# Altium schematic sheet 16_FPGA_pwr_banks.SchDoc: FPGA power banks
size A3; Organization: Lime Microsystems; Address1: Surrey Tech Centre; Address2: Guildford GU2 7YG; Address3: Surrey; Address4: United Kingdom; Revision: v1.2; SheetNumber: 14; SheetTotal: 27
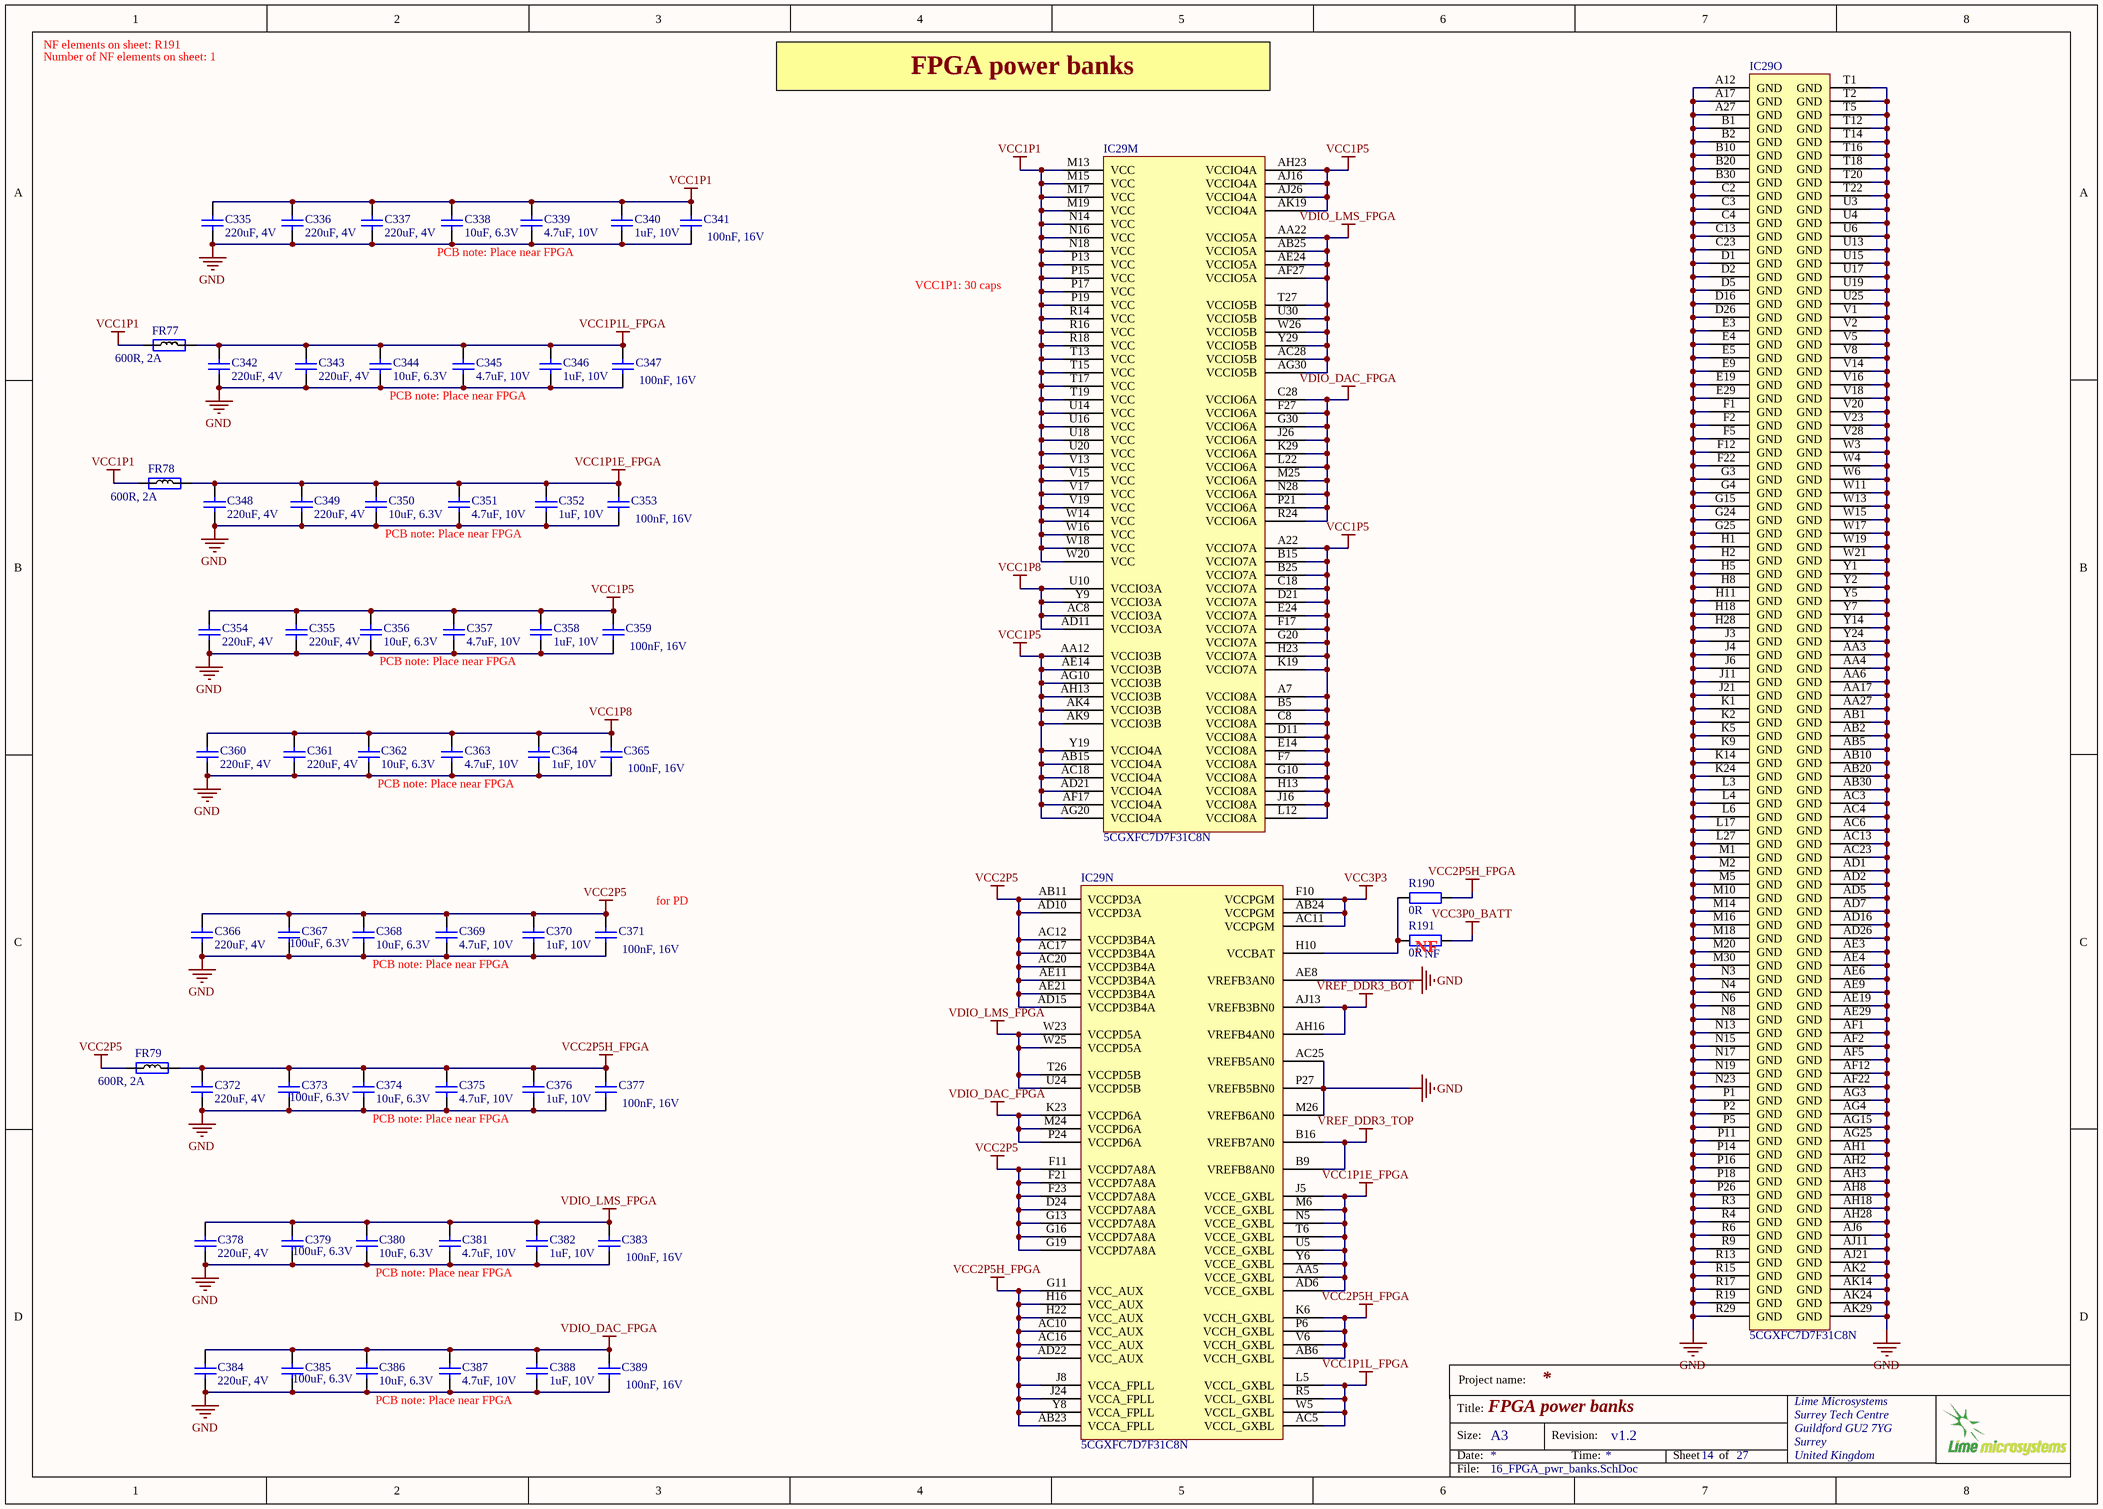
[diagram p0: 16_FPGA_pwr_banks.SchDoc]

## Parts
C335  220uF, 4V  [CAP1206]
C336  220uF, 4V  [CAP1206]
C337  220uF, 4V  [CAP1206]
C338  10uF, 6.3V  [CAP0603]
C339  4.7uF, 10V  [CAP0603]
C340  1uF, 10V  [CAP0402]
C341  100nF, 16V  [CAP0402]
C342  220uF, 4V  [CAP1206]
C343  220uF, 4V  [CAP1206]
C344  10uF, 6.3V  [CAP0603]
C345  4.7uF, 10V  [CAP0603]
C346  1uF, 10V  [CAP0402]
C347  100nF, 16V  [CAP0402]
C348  220uF, 4V  [CAP1206]
C349  220uF, 4V  [CAP1206]
C350  10uF, 6.3V  [CAP0603]
C351  4.7uF, 10V  [CAP0603]
C352  1uF, 10V  [CAP0402]
C353  100nF, 16V  [CAP0402]
C354  220uF, 4V  [CAP1206]
C355  220uF, 4V  [CAP1206]
C356  10uF, 6.3V  [CAP0603]
C357  4.7uF, 10V  [CAP0603]
C358  1uF, 10V  [CAP0402]
C359  100nF, 16V  [CAP0402]
C360  220uF, 4V  [CAP1206]
C361  220uF, 4V  [CAP1206]
C362  10uF, 6.3V  [CAP0603]
C363  4.7uF, 10V  [CAP0603]
C364  1uF, 10V  [CAP0402]
C365  100nF, 16V  [CAP0402]
C366  220uF, 4V  [CAP1206]
C367  100uF, 6.3V  [CAP1206]
C368  10uF, 6.3V  [CAP0603]
C369  4.7uF, 10V  [CAP0603]
C370  1uF, 10V  [CAP0402]
C371  100nF, 16V  [CAP0402]
C372  220uF, 4V  [CAP1206]
C373  100uF, 6.3V  [CAP1206]
C374  10uF, 6.3V  [CAP0603]
C375  4.7uF, 10V  [CAP0603]
C376  1uF, 10V  [CAP0402]
C377  100nF, 16V  [CAP0402]
C378  220uF, 4V  [CAP1206]
C379  100uF, 6.3V  [CAP1206]
C380  10uF, 6.3V  [CAP0603]
C381  4.7uF, 10V  [CAP0603]
C382  1uF, 10V  [CAP0402]
C383  100nF, 16V  [CAP0402]
C384  220uF, 4V  [CAP1206]
C385  100uF, 6.3V  [CAP1206]
C386  10uF, 6.3V  [CAP0603]
C387  4.7uF, 10V  [CAP0603]
C388  1uF, 10V  [CAP0402]
C389  100nF, 16V  [CAP0402]
FR77  600R, 2A  [RES0805]
FR78  600R, 2A  [RES0805]
FR79  600R, 2A  [RES0805]
IC29  5CGXFC7D7F31C8N  [ALTR-FBGA896_A-200]  (parts M,N,O of 16)
R190  0R  [RES0402]
R191  0R  Assembly Info: NF  [RES0402]

## Nets
GND: C335.1 C336.1 C337.1 C338.1 C339.1 C340.2 C341.2 C342.1 C343.1 C344.1 C345.1 C346.1 C347.2 C348.1 C349.1 C350.1 C351.1 C352.1 C353.2 C354.1 C355.1 C356.1 C357.1 C358.1 C359.2 C360.1 C361.1 C362.1 C363.1 C364.1 C365.2 C366.1 C367.1 C368.1 C369.1 C370.1 C371.2 C372.1 C373.1 C374.1 C375.1 C376.1 C377.2 C378.1 C379.1 C380.1 C381.1 C382.1 C383.2 C384.1 C385.1 C386.1 C387.1 C388.1 C389.2 IC29.A12(GND) IC29.A17(GND) IC29.A27(GND) IC29.AA3(GND) IC29.AA4(GND) IC29.AA6(GND) IC29.AA17(GND) IC29.AA27(GND) IC29.AB1(GND) IC29.AB2(GND) IC29.AB5(GND) IC29.AB10(GND) IC29.AB20(GND) IC29.AB30(GND) IC29.AC3(GND) IC29.AC4(GND) IC29.AC6(GND) IC29.AC13(GND) IC29.AC23(GND) IC29.AC25(VREFB5AN0) IC29.AD1(GND) IC29.AD2(GND) IC29.AD5(GND) IC29.AD7(GND) IC29.AD16(GND) IC29.AD26(GND) IC29.AE3(GND) IC29.AE4(GND) IC29.AE6(GND) IC29.AE8(VREFB3AN0) IC29.AE9(GND) IC29.AE19(GND) IC29.AE29(GND) IC29.AF1(GND) IC29.AF2(GND) IC29.AF5(GND) IC29.AF12(GND) IC29.AF22(GND) IC29.AG3(GND) IC29.AG4(GND) IC29.AG15(GND) IC29.AG25(GND) IC29.AH1(GND) IC29.AH2(GND) IC29.AH3(GND) IC29.AH8(GND) IC29.AH18(GND) IC29.AH28(GND) IC29.AJ6(GND) IC29.AJ11(GND) IC29.AJ21(GND) IC29.AK2(GND) IC29.AK14(GND) IC29.AK24(GND) IC29.AK29(GND) IC29.B1(GND) IC29.B2(GND) IC29.B10(GND) IC29.B20(GND) IC29.B30(GND) IC29.C2(GND) IC29.C3(GND) IC29.C4(GND) IC29.C13(GND) IC29.C23(GND) IC29.D1(GND) IC29.D2(GND) IC29.D5(GND) IC29.D16(GND) IC29.D26(GND) IC29.E3(GND) IC29.E4(GND) IC29.E5(GND) IC29.E9(GND) IC29.E19(GND) IC29.E29(GND) IC29.F1(GND) IC29.F2(GND) IC29.F5(GND) IC29.F12(GND) IC29.F22(GND) IC29.G3(GND) IC29.G4(GND) IC29.G15(GND) IC29.G24(GND) IC29.G25(GND) IC29.H1(GND) IC29.H2(GND) IC29.H5(GND) IC29.H8(GND) IC29.H11(GND) IC29.H18(GND) IC29.H28(GND) IC29.J3(GND) IC29.J4(GND) IC29.J6(GND) IC29.J11(GND) IC29.J21(GND) IC29.K1(GND) IC29.K2(GND) IC29.K5(GND) IC29.K9(GND) IC29.K14(GND) IC29.K24(GND) IC29.L3(GND) IC29.L4(GND) IC29.L6(GND) IC29.L17(GND) IC29.L27(GND) IC29.M1(GND) IC29.M2(GND) IC29.M5(GND) IC29.M10(GND) IC29.M14(GND) IC29.M16(GND) IC29.M18(GND) IC29.M20(GND) IC29.M26(VREFB6AN0) IC29.M30(GND) IC29.N3(GND) IC29.N4(GND) IC29.N6(GND) IC29.N8(GND) IC29.N13(GND) IC29.N15(GND) IC29.N17(GND) IC29.N19(GND) IC29.N23(GND) IC29.P1(GND) IC29.P2(GND) IC29.P5(GND) IC29.P11(GND) IC29.P14(GND) IC29.P16(GND) IC29.P18(GND) IC29.P26(GND) IC29.P27(VREFB5BN0) IC29.R3(GND) IC29.R4(GND) IC29.R6(GND) IC29.R9(GND) IC29.R13(GND) IC29.R15(GND) IC29.R17(GND) IC29.R19(GND) IC29.R29(GND) IC29.T1(GND) IC29.T2(GND) IC29.T5(GND) IC29.T12(GND) IC29.T14(GND) IC29.T16(GND) IC29.T18(GND) IC29.T20(GND) IC29.T22(GND) IC29.U3(GND) IC29.U4(GND) IC29.U6(GND) IC29.U13(GND) IC29.U15(GND) IC29.U17(GND) IC29.U19(GND) IC29.U25(GND) IC29.V1(GND) IC29.V2(GND) IC29.V5(GND) IC29.V8(GND) IC29.V14(GND) IC29.V16(GND) IC29.V18(GND) IC29.V20(GND) IC29.V23(GND) IC29.V28(GND) IC29.W3(GND) IC29.W4(GND) IC29.W6(GND) IC29.W11(GND) IC29.W13(GND) IC29.W15(GND) IC29.W17(GND) IC29.W19(GND) IC29.W21(GND) IC29.Y1(GND) IC29.Y2(GND) IC29.Y5(GND) IC29.Y7(GND) IC29.Y14(GND) IC29.Y24(GND)
VCC1P1: C335.2 C336.2 C337.2 C338.2 C339.2 C340.1 C341.1 FR77.1 FR78.1 IC29.M13(VCC) IC29.M15(VCC) IC29.M17(VCC) IC29.M19(VCC) IC29.N14(VCC) IC29.N16(VCC) IC29.N18(VCC) IC29.P13(VCC) IC29.P15(VCC) IC29.P17(VCC) IC29.P19(VCC) IC29.R14(VCC) IC29.R16(VCC) IC29.R18(VCC) IC29.T13(VCC) IC29.T15(VCC) IC29.T17(VCC) IC29.T19(VCC) IC29.U14(VCC) IC29.U16(VCC) IC29.U18(VCC) IC29.U20(VCC) IC29.V13(VCC) IC29.V15(VCC) IC29.V17(VCC) IC29.V19(VCC) IC29.W14(VCC) IC29.W16(VCC) IC29.W18(VCC) IC29.W20(VCC)
VCC1P1E_FPGA: C348.2 C349.2 C350.2 C351.2 C352.2 C353.1 FR78.2 IC29.AA5(VCCE_GXBL) IC29.AD6(VCCE_GXBL) IC29.J5(VCCE_GXBL) IC29.M6(VCCE_GXBL) IC29.N5(VCCE_GXBL) IC29.T6(VCCE_GXBL) IC29.U5(VCCE_GXBL) IC29.Y6(VCCE_GXBL)
VCC1P1L_FPGA: C342.2 C343.2 C344.2 C345.2 C346.2 C347.1 FR77.2 IC29.AC5(VCCL_GXBL) IC29.L5(VCCL_GXBL) IC29.R5(VCCL_GXBL) IC29.W5(VCCL_GXBL)
VCC1P5: C354.2 C355.2 C356.2 C357.2 C358.2 C359.1 IC29.A7(VCCIO8A) IC29.A22(VCCIO7A) IC29.AA12(VCCIO3B) IC29.AB15(VCCIO4A) IC29.AC18(VCCIO4A) IC29.AD21(VCCIO4A) IC29.AE14(VCCIO3B) IC29.AF17(VCCIO4A) IC29.AG10(VCCIO3B) IC29.AG20(VCCIO4A) IC29.AH13(VCCIO3B) IC29.AH23(VCCIO4A) IC29.AJ16(VCCIO4A) IC29.AJ26(VCCIO4A) IC29.AK4(VCCIO3B) IC29.AK9(VCCIO3B) IC29.AK19(VCCIO4A) IC29.B5(VCCIO8A) IC29.B15(VCCIO7A) IC29.B25(VCCIO7A) IC29.C8(VCCIO8A) IC29.C18(VCCIO7A) IC29.D11(VCCIO8A) IC29.D21(VCCIO7A) IC29.E14(VCCIO8A) IC29.E24(VCCIO7A) IC29.F7(VCCIO8A) IC29.F17(VCCIO7A) IC29.G10(VCCIO8A) IC29.G20(VCCIO7A) IC29.H13(VCCIO8A) IC29.H23(VCCIO7A) IC29.J16(VCCIO8A) IC29.K19(VCCIO7A) IC29.L12(VCCIO8A) IC29.Y19(VCCIO4A)
VCC1P8: C360.2 C361.2 C362.2 C363.2 C364.2 C365.1 IC29.AC8(VCCIO3A) IC29.AD11(VCCIO3A) IC29.U10(VCCIO3A) IC29.Y9(VCCIO3A)
VCC2P5: C366.2 C367.2 C368.2 C369.2 C370.2 C371.1 FR79.1 IC29.AB11(VCCPD3A) IC29.AC12(VCCPD3B4A) IC29.AC17(VCCPD3B4A) IC29.AC20(VCCPD3B4A) IC29.AD10(VCCPD3A) IC29.AD15(VCCPD3B4A) IC29.AE11(VCCPD3B4A) IC29.AE21(VCCPD3B4A) IC29.D24(VCCPD7A8A) IC29.F11(VCCPD7A8A) IC29.F21(VCCPD7A8A) IC29.F23(VCCPD7A8A) IC29.G13(VCCPD7A8A) IC29.G16(VCCPD7A8A) IC29.G19(VCCPD7A8A)
VCC2P5H_FPGA: C372.2 C373.2 C374.2 C375.2 C376.2 C377.1 FR79.2 IC29.AB6(VCCH_GXBL) IC29.AB23(VCCA_FPLL) IC29.AC10(VCC_AUX) IC29.AC16(VCC_AUX) IC29.AD22(VCC_AUX) IC29.G11(VCC_AUX) IC29.H16(VCC_AUX) IC29.H22(VCC_AUX) IC29.J8(VCCA_FPLL) IC29.J24(VCCA_FPLL) IC29.K6(VCCH_GXBL) IC29.P6(VCCH_GXBL) IC29.V6(VCCH_GXBL) IC29.Y8(VCCA_FPLL) R190.1
VCC3P0_BATT: R191.1
VCC3P3: IC29.AB24(VCCPGM) IC29.AC11(VCCPGM) IC29.F10(VCCPGM)
VDIO_DAC_FPGA: C384.2 C385.2 C386.2 C387.2 C388.2 C389.1 IC29.C28(VCCIO6A) IC29.F27(VCCIO6A) IC29.G30(VCCIO6A) IC29.J26(VCCIO6A) IC29.K23(VCCPD6A) IC29.K29(VCCIO6A) IC29.L22(VCCIO6A) IC29.M24(VCCPD6A) IC29.M25(VCCIO6A) IC29.N28(VCCIO6A) IC29.P21(VCCIO6A) IC29.P24(VCCPD6A) IC29.R24(VCCIO6A)
VDIO_LMS_FPGA: C378.2 C379.2 C380.2 C381.2 C382.2 C383.1 IC29.AA22(VCCIO5A) IC29.AB25(VCCIO5A) IC29.AC28(VCCIO5B) IC29.AE24(VCCIO5A) IC29.AF27(VCCIO5A) IC29.AG30(VCCIO5B) IC29.T26(VCCPD5B) IC29.T27(VCCIO5B) IC29.U24(VCCPD5B) IC29.U30(VCCIO5B) IC29.W23(VCCPD5A) IC29.W25(VCCPD5A) IC29.W26(VCCIO5B) IC29.Y29(VCCIO5B)
VREF_DDR3_BOT: IC29.AH16(VREFB4AN0) IC29.AJ13(VREFB3BN0)
VREF_DDR3_TOP: IC29.B9(VREFB8AN0) IC29.B16(VREFB7AN0)
NetIC29_H10: IC29.H10(VCCBAT) R190.2 R191.2

## Notes on the sheet
- NF elements on sheet: R191
- Number of NF elements on sheet: 1
- FPGA power banks
- PCB note: Place near FPGA
- VCC1P1: 30 caps
- (near C371) for PD
- (near R191) NF
- Project name:
- Title:
- Size:
- Date:
- A3
- Revision:
- Time:
- Sheet
- of
- File:

## Library data of the parts
C335-C337 C342 C343 C348 C349 C354 C355 C360 C361 C366 C372 C378 C384 = Cap_1206: Manufacturer Part Number: GRM31CR60G227ME11L; Manufacturer: Murata Electronics North America; Part Description: 220µF ±20% 4V Ceramic Capacitor X5R 1206 (3216 Metric); Capacitance: 220µF; Temperature Coefficient: X5R; Tolerance: ±20%; Package / Case: 1206 (3216 Metric); Supplier 1: Digi-Key; Packaging: Cut Tape (CT); Size / Dimension: 0.126" L x 0.063" W (3.20mm x 1.60mm); Operating Temperature: -55°C ~ 85°C; Voltage - Rated: 4V; Mounting Type: Surface Mount, MLCC; Ratings: -; Supplier Part Number 1: 490-9774-1-ND; Category: Capacitors; Lead Spacing: -; Lead Style: -; Applications: General Purpose; Features: -; Height - Seated (Max): -; Thickness (Max): 0.075" (1.90mm); RoHS: RoHS Compliant; Value: 220uF, 4V
C338 C344 C350 C356 C362 C368 C374 C380 C386 = Cap_0603: Manufacturer Part Number 1: CC0603MRX5R5BB106; Part Description: 10µF ±20% 6.3V Ceramic Capacitor X5R 0603 (1608 Metric); Manufacturer: Yageo; Capacitance: 10µF; Tolerance: ±20%; Supplier 1: Digi-Key; Supplier Part Number 1: 311-1448-2-ND; Package / Case: 0603 (1608 Metric); Category: Capacitors; Voltage - Rated: 6.3V; Value: 10uF, 6.3V
C339 C345 C351 C357 C363 C369 C375 C381 C387 = Cap_0603: Manufacturer Part Number 1: CGB3B1X5R1A475K055AC; Part Description: 4.7µF ±10% 10V Ceramic Capacitor X5R 0603 (1608 Metric); Manufacturer: TDK Corporation; Tolerance: 10 %; Temperature Coefficient / Code: +/- 15 %; Supplier 1: Mouser; Supplier Part Number 1: 810-CGB3B1X5R1A475KC; Capacitance: 4.7 uF; Operating Temperature Range: - 55 C to + 85 C; Voltage Rating DC: 10 V; Category: Multilayer Ceramic Capacitors MLCC - SMD/SMT; Case Code - in: 0603; Package / Case: 0603 (1608 metric); value: 4.7uF, 10V
C340 C346 C352 C358 C364 C370 C376 C382 C388 = Cap_0402: Manufacturer Part Number 1: GRM155R61A105KE15J; Manufacturer: TDK; Part Description: 1µF ±10% 10V Ceramic Capacitor X5R 0402 (1005 Metric); Voltage Rating: 10; Capacitance Tolerance: ± 10%; Product Range: TDK - C Series; Ceramic Capacitor Case: 0402 [1005 Metric]; Capacitance: 1; Dielectric Characteristic: X6; Value: 1uF, 10V; Supplier 1: Newark; Supplier Part Number 1: 490-6298-2-ND; MSL: -; RoHS: YES
C341 C347 C353 C359 C365 C371 C377 C383 C389 = Cap_0603: Manufacturer Part Number 1: GRM155R71C104KA88D; Part Description: 0.10µF ±10% 16V Ceramic Capacitor X7R 0402 (1005 Metric); Brand: Murata Electronics; Tolerance: 10 %; Type: General Purpose MLCC; Capacitance: 0.1 uF; Temperature Coefficient / Code: +/- 15 %; Case Height: 0.5 mm; Case Length: 1 mm; Dielectric: X7R; Supplier 1: Mouser; Supplier Part Number 1: 81-GRM155R71C104KA88; Case Code - in: 0402; Manufacturer: Murata Electronics; Category: Multilayer Ceramic Capacitors MLCC - SMD/SMT; Voltage Rating DC: 16 V; Value: 100nF, 16V; Manufacturer Part Number: GRM155R71C104KA88D; Case Code - mm: 1005; Case Width: 0.5 mm; Maximum Operating Temperature: + 125 C; Minimum Operating Temperature: - 55 C; Minimum Order Quantity: 1; Operating Temperature Range: - 55 C to + 125 C; Package / Case: 0402 (1005 metric); Packaging: Reel; Product: General Type MLCCs; Product Category: Low & Medium Capacitance SMD Ceramic Chip Capacitors; Reeling: True; RoHS - Mouser: Y; RoHS: RoHS Compliant; Series: GRM; Standard Pack Qty: 10000; Termination Style: SMD/SMT
C367 C373 C379 C385 = Cap_1206: Manufacturer: MURATA; Manufacturer Part Number 1: GRM31CR60J107ME39L.; Part Description: SMD Multilayer Ceramic Capacitor, 1206 [3216 Metric], 100 µF, 6.3 V, ± 20%, X5R, GRM Series; Capacitance Tolerance: ± 20%; Ceramic Capacitor Case: 1206 [3216 Metric]; Voltage Rating: 6.3; value: 100uF, 6.3V; Supplier Part Number 1: 1735535; Supplier 1: Farnell
FR77-FR79 = Ferrite: Manufacturer Part Number 1: MPZ2012S601A; Manufacturer: TDK; Part Description: FERRITE BEAD 600 OHM 0805 1LN; Filter Type: Differential Mode - Single; Impedance @ Frequency: 600 Ohm @ 100MHz; DC Resistance (DCR): 100 mOhm Max; DC Current Rating: 2; DC Resistance Max: 0.1; Ferrite Case Style: 0805 [2012 Metric]; Ferrite Mounting: SMD; Impedance @ 100MHz: 600; Impedance Tolerance: ± 25%; Supplier 1: Farnell; Supplier Part Number 1: 1669753RL; Mounting Type: Surface Mount; RoHS: RoHS Compliant; Height (Max): 0.041" (1.05mm); Packaging: Tape & Reel (TR); Category: Filters; Current Rating: 2A; Package / Case: 0805 (2012 Metric); Size / Dimension: 0.079" L x 0.049" W (2.00mm x 1.25mm); Value: 600R, 2A; Core Material: Ferrite; Supplier: Farnell
IC29 = 5CGXFC7D7F31C8N: Cyclone V GX Family FPGA, 1.07 to 1.13 V Supply, 480 I/O Pins, 7 PLLs, 896-Pin FBGA, Speed Grade 8, Commercial Grade, RoHS Compliant; Manufacturer: Altera; Part Description: IC FPGA 480 I/O 896FBGA; GPIO: 480; Logic Elements (LE) (K): 149.5; Speed Grade: 8; DatasheetVersion: Rev. 3.4; PackageVersion: Rev. 2.0, 12/2012; PackageReference: FBGA896_A-200; PackageDescription: 896-Pin FineLine Ball-Grid Array (FBGA), Body 31 x 31 mm, Pitch 1 mm; Supplier 1: Digi-Key; Supplier Part Number 1: 544-2772-ND; Supplier 2: Mouser; Supplier Part Number 2: 989-5CGXFC7D7F31C8N; Device Group: 5CGXFC7; RoHS: RoHS Compliant; Subcategory: Cyclone V GX; Voltage Supply: 1.07 to 1.13 V; NexusDeviceID: 5CGXFC7D7F31C8N; Mounting Technology: Surface Mount; Code_JEDEC: MS-034-AAN-1; PartNumber: 5CGXFC7D7F31C8N; ComponentLink1Description: Manufacturer URL; ComponentLink1URL: http://www.altera.com; ComponentLink2Description: Datasheet; ComponentLink2URL: http://www.altera.com/literature/hb/cyclone-v/cv_51002.pdf; ComponentLink3Description: Package Specification; ComponentLink3URL: http://www.altera.com/devicepackaging/04R00435-01.pdf; ComponentLink4Description: Device Handbook URL; ComponentLink4URL: http://www.altera.com/literature/hb/cyclone-v/cyclone5_handbook.pdf; ComponentLink5Description: Device Pin-Out URL; ComponentLink5URL: http://www.altera.com/literature/dp/cyclone-v/5CGXFC7.xls; ComponentLink6Description: Device Overview URL; ComponentLink6URL: http://www.altera.com/literature/hb/cyclone-v/cv_51001.pdf; ComponentLink7Description: Product URL; ComponentLink7URL: http://www.buyaltera.com/scripts/partsearch.dll?Detail&name=5CGXFC7D7F31C8N-ND
R190 R191 = Res_0402: Manufacturer Part Number 1: RC0402JR-070RL; Manufacturer: Yageo; Part Description: RES SMD 0.0OHM JUMPER 1/16W 0402; Resistance (Ohms): 0.0; Tolerance: Jumper; Power (Watts): 0.063W, 1/16W; Value: 0R; Supplier 1: Digi-Key; Supplier Part Number 1: 311-0.0JRTR-ND; Category: Resistors; Temperature Coefficient: -; Features: Moisture Resistant; Supplier Device Package: 0402; Height: 0.016" (0.40mm); Package / Case: 0402 (1005 Metric); Operating Temperature: -55°C ~ 155°C; Size / Dimension: 0.039" L x 0.020" W (1.00mm x 0.50mm); Composition: Thick Film; Packaging: Tape & Reel (TR); Number of Terminations: 2; RoHS: RoHS Compliant